# EAGLE design amc7135-24mm-RGBW-led-driver-with-butt-mk-1.0 (EAGLE 7.5.0)
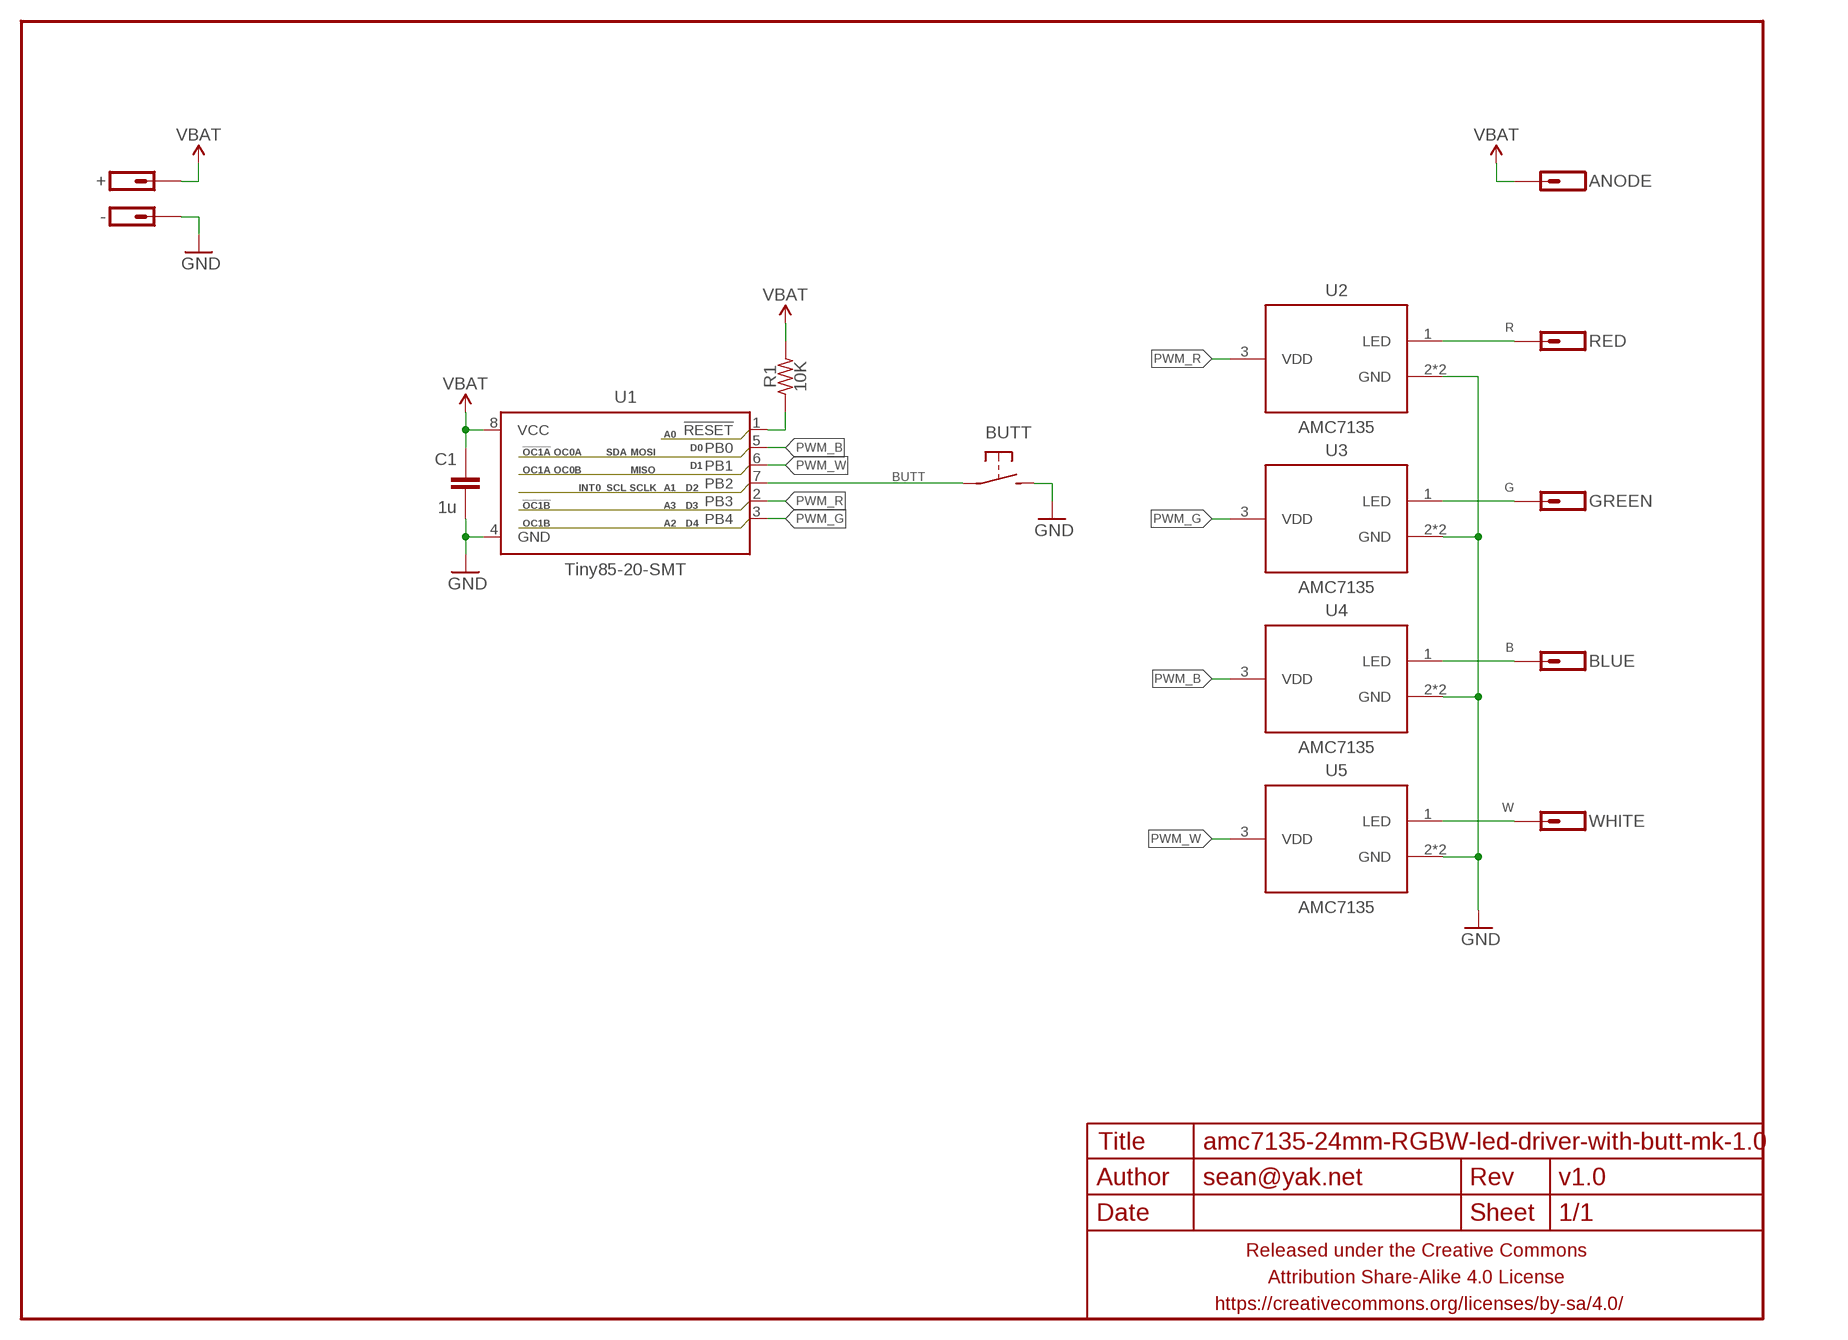
[diagram p0: schematic, sheet 1]

## Parts
+  M01NOSTOP-CANTSTOP-DONTKNOWHOWTOSTOP  [1X01_SMD_NOSTOP_NOSILK]
-  M01NOT-A-VIA-NOPE  [1X01_NOSILK_NOSTOP]
ANODE  M01PTH-1.2MM-NS  [1X01-1.2MM-NS]
BLUE  M01PTH-1MM-CIR-NS  [1X01-1MM-CIR-NS]
BUTT  SPST-NO-TACT3MM-RA  [TACTILE-PTH-SIDE]
C1  1u  CAPACITOR-CERAMICC0402  [C0402]
FRAME1  FRAME-LETTERNO_PACKAGE  [DUMMY]
GREEN  M01PTH-1MM-CIR-NS  [1X01-1MM-CIR-NS]
R1  10K  RESISTORR0402  [R0402]
RED  M01PTH-1MM-CIR-NS  [1X01-1MM-CIR-NS]
U1  Tiny85-20-SMT  ATTINY45TINY85-20-SOICW  [SO08-EIAJ]
U2  AMC7135  AMC7135SOT-89  [SOT89]
U3  AMC7135  AMC7135SOT-89  [SOT89]
U4  AMC7135  AMC7135SOT-89  [SOT89]
U5  AMC7135  AMC7135SOT-89  [SOT89]
WHITE  M01PTH-1MM-CIR-NS  [1X01-1MM-CIR-NS]

## Nets
B: BLUE.1 U4.1(LED)
BUTT: BUTT.1 U1.7(PB2)
G: GREEN.1 U3.1(LED)
GND: -.P$1 BUTT.2 C1.2 U1.4(GND) U2.2(GND) U2.4(GND) U3.2(GND) U3.4(GND) U4.2(GND) U4.4(GND) U5.2(GND) U5.4(GND)
N$4: R1.1 U1.1(!RESET)
PWM_B: U1.5(PB0) U4.3(VDD)
PWM_G: U1.3(PB4) U3.3(VDD)
PWM_R: U1.2(PB3) U2.3(VDD)
PWM_W: U1.6(PB1) U5.3(VDD)
R: RED.1 U2.1(LED)
VBAT: +.1 ANODE.P$1 C1.1 R1.2 U1.8(VCC)
W: U5.1(LED) WHITE.1

## Library data of the parts
+ - ANODE BLUE GREEN RED WHITE = a_parts:M01: Header 1 Standard 1-pin 0.1" header. Use with straight break away headers (SKU : PRT-00116), right angle break away headers (PRT-00553), swiss pins (PRT-00743), machine pins (PRT-00117), and female headers (PRT-00115).
BUTT = a_parts:SPST-NO-TACT
C1 = a_parts:CAPACITOR-CERAMIC: CAPACITOR, European symbol
FRAME1 = a_parts:FRAME-LETTER: Schematic Frame Standard 8.5x11 US Letter frame; DESIGNER: sean@yak.net; VERSION: v1.0
R1 = a_parts:RESISTOR: RESISTOR, American symbol
U1 = a_parts:ATTINY45: Atmel 8-pin 2/4/8kB flash uC; PROD_ID: IC-09092
U2-U5 = a_parts:AMC7135

## Board
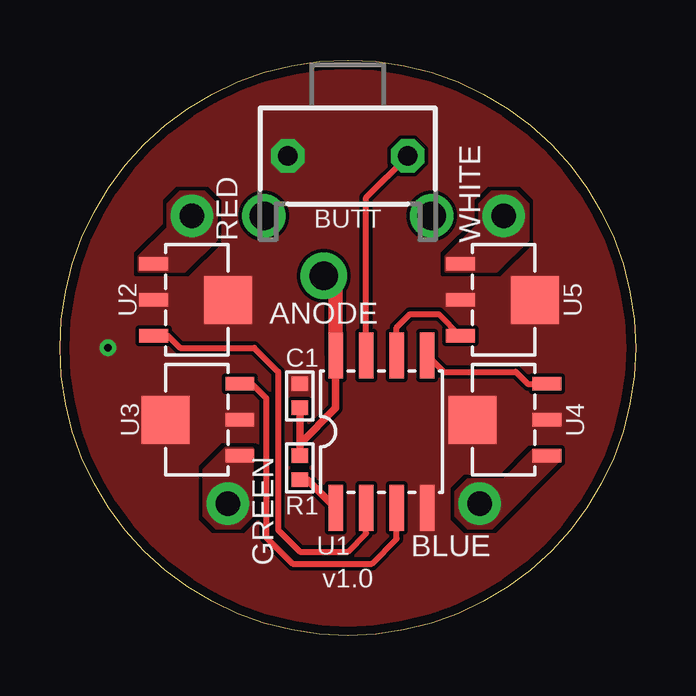
[diagram p1: board, top side]
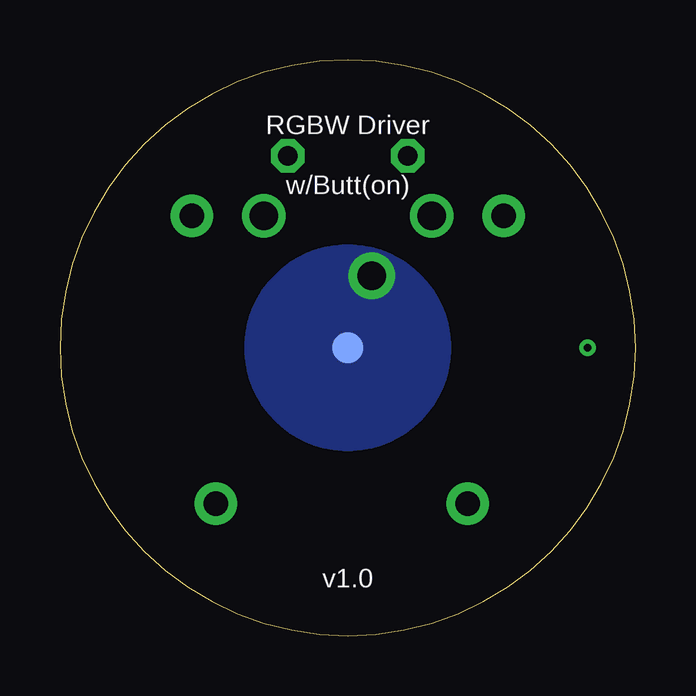
[diagram p2: board, bottom side, seen from below]

Size 24 x 24 mm. Coordinates in mm from the lower left corner, seen from the top.
Outline: 0,12 arc-180 24,12 arc-180 0,12
Copper layers (1*16): Top 0.0356mm / dielectric 1.5011mm / Bottom 0.0356mm
Design rules "LaenPCBOrder2": minimum track width 6mil, minimum drill 13mil, track to track 6mil, track to pad 6mil, pad to pad 6mil, via to via 6mil, smd to smd 6mil, copper to edge 15mil, drill to drill 6mil, minimum pad ring 7mil, minimum via ring 7mil, stop-mask expansion 3mil, vias tented up to drill 20mil, thermal gap 10mil

### Footprints (pad centres in the part's own frame; a part is rotated, then mirrored left to right if it is on the bottom)
1X01_SMD_NOSTOP_NOSILK = smd 1.27 x 1.27: 1 0,0
1X01_NOSILK_NOSTOP = drill 0.33: P$1 0,0
1X01-1.2MM-NS = drill 1.2 pad 1.93: P$1 0,0
1X01-1MM-CIR-NS = drill 1.016 pad 1.778: 1 0,0
TACTILE-PTH-SIDE = drill 0.8 pad 1.4 octagon: 1 -2.5,0; 2 2.5,0 | drill 1.2 pad 1.778: ANCHOR1 -3.5,2.5; ANCHOR2 3.5,2.5
C0402 = smd 0.6 x 0.7: 1 -0.5,0; 2 0.5,0
R0402 = smd 0.6 x 0.7: 1 -0.5,0; 2 0.5,0
SO08-EIAJ = smd 0.61 x 1.905: 1 -1.905,-3.175; 2 -0.635,-3.175; 3 0.635,-3.175; 4 1.905,-3.175; 5 1.905,3.175; 6 0.635,3.175; 7 -0.635,3.175; 8 -1.905,3.175
SOT89 = smd 0.58 x 1.2: 1 -1.5,-1.8; 2 0,-1.8; 3 1.5,-1.8 | smd 2 x 2: 4 0,1.3

### Placement (x,y rotation side)
+  12,12 0 bottom
-  2,12 90 bottom
ANODE  11,15 90 top
BLUE  17.5,5.5 0 top
BUTT  12,20 180 top
C1  10,10 90 top
FRAME1  0,0 0 top
GREEN  7,5.5 180 top
R1  10,7 90 top
RED  5.5,17.5 0 top
U1  13.4,8.5 0 top
U2  5.7,14 270 top
U3  5.7,9 90 top
U4  18.5,9 90 top
U5  18.5,14 270 top
WHITE  18.5,17.5 0 top

### Tracks (layer width: path | path; a pad name or v marks a point on that pad's centre or on a via)
B
  pour Top (isolate 0.152, no thermals): 17,4.5 16.5,5 16.5,6 17,6.5 18,6.5 18.5,6.5 19.7,7.7 20.8,7.7 20.8,7.3 18,4.5
BUTT
  Top 0.25: U1.7 12.77,18.27 BUTT.1
G
  pour Top (isolate 0.152, no thermals): 6,5 6.5,4.5 7.5,4.5 8,5 8,7.8 6.9,7.8 6,6.9
GND
  pour Top (isolate 0.152, rank 6, no thermals): 0,0 24,0 24,24 0,24
N$4
  Top 0.305: U1.1 10.32,6.5 R1.1
PWM_B
  Top 0.25: U1.5 15.32,11.68 16,11 19,11 19.5,10.5 U4.3
PWM_G
  Top 0.25: U3.3 8,10.5 8.6,9.9 8.6,4.1 9.7,3 13,3 14.04,4.04 U1.3
PWM_R
  Top 0.25: U2.3 4.5,12.5 5,12 8.1,12 9.1,11 9.1,4.4 10,3.5 12,3.5 12.77,4.26 U1.2
PWM_W
  Top 0.25: U1.6 14.04,12.84 14.6,13.4 15.8,13.4 U5.3
R
  pour Top (isolate 0.152, no thermals): 3.3,15.2 5.2,15.2 6.5,16.5 6.5,18 6,18.5 5,18.5 4.5,18 4.5,17 3.3,15.8
VBAT
  Top 0.305: U1.8 11.49,9.49 10,8 | 10,8 R1.2 | C1.1 10,8
  Top 0.61: U1.8 11.49,14.51 ANODE.P$1
  pour Bottom (isolate 0.152, no thermals): 9,15 arc-90 15,15 arc-90 15,9 arc-90 9,9 arc-90
W
  pour Top (isolate 0.152, no thermals): 16.1,15.8 17.5,17.2 17.5,18 18,18.5 19,18.5 19.5,18 19.5,16.5 18.2,15.2 16.1,15.2

### Text on the board
bPlace: RGBW Driver | w/Butt(on)